# Altium schematic sheet Priority_Encoder.SchDoc
size 431 x 279 mm; Organization: ORGANIZATION; Address1: ADDRESS 1; Address2: ADDRESS 2; Address3: ADDRESS 3; Address4: ADDRESS 4; Revision: -; SheetNumber: 2; SheetTotal: 4; ENG_APP_DATE: --/--/--; DSN_APP_DATE: --/--/--; CHK_APP_DATE: --/--/--
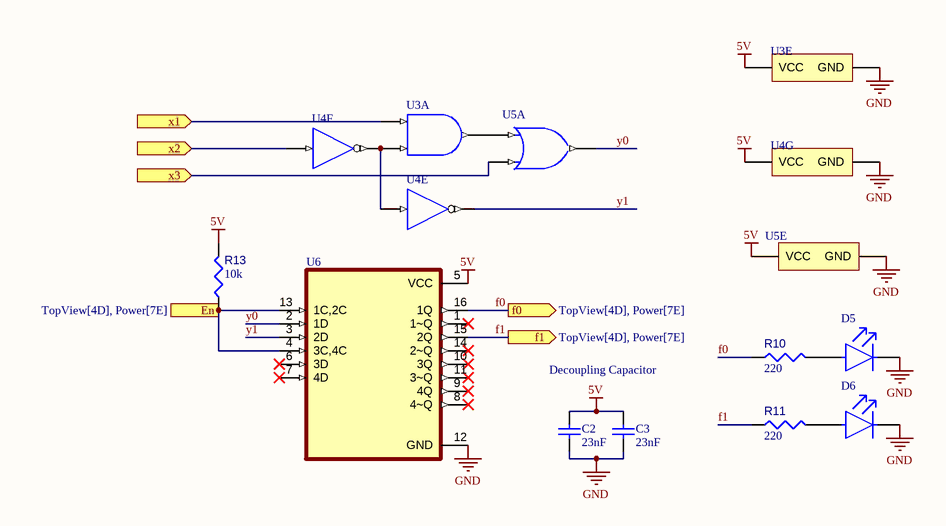
[diagram p0: Priority_Encoder.SchDoc]

## Parts
C2  23nF  [KEMT-C315-THT-2]
C3  23nF  [KEMT-C315-THT-2]
D5  LTL2P3KGKNN  [FP-LTL2P3KGKNN-MFG]  (value not drawn)
D6  LTL2P3KGKNN  [FP-LTL2P3KGKNN-MFG]  (value not drawn)
R10  value 220  [RESA60-630X240]  (hidden comment: MFR-25FBF52-100R)
R11  value 220  [RESA60-630X240]  (hidden comment: MFR-25FBF52-100R)
R13  10k  [RESA60-630X240]
U3  SN74LS08N  [N0014A]  (value not drawn)  (parts A,E of 5)
U4  SN74LS04N  [N0014A]  (value not drawn)  (parts E,F,G of 7)
U5  SN74LS32N  [N0014A]  (value not drawn)  (parts A,E of 5)
U6  SN74LS75N  [DIP794W45P254L1969H508Q16]  (value not drawn)

## Ports
En (in, see TopView[4D], Power[7E]), f0 (out, see TopView[4D], Power[7E]), f1 (out, see TopView[4D], Power[7E]), x1 (in, see TopView[5E], ADC_Logic[5C]), x2 (in, see TopView[5E], ADC_Logic[5D]), x3 (in, see TopView[5E], ADC_Logic[5D])

## Nets
5V: C2.2 C3.2 R13.2 U3.14(VCC) U4.14(VCC) U5.14(VCC) U6.5(VCC)
GND: C2.1 C3.1 D5.1(C) D6.1(C) U3.7(GND) U4.7(GND) U5.7(GND) U6.12(GND)
En: R13.1 U6.4(3C,4C) U6.13(1C,2C) ; port En
f0: R10.1 U6.16(1Q) ; port f0
f1: R11.1 U6.15(2Q) ; port f1
x1: U3.1(1A) ; port x1
x2: U4.13(6A) ; port x2
x3: U5.2(1B) ; port x3
y0: U5.3(1Y) U6.2(1D)
y1: U4.10(~{5Y}) U6.3(2D)
NetD5_2: D5.2(A) R10.2
NetD6_2: D6.2(A) R11.2
NetU3_2: U3.2(1B) U4.11(5A) U4.12(~{6Y})
NetU3_3: U3.3(1Y) U5.1(1A)

Not connected (* = marked no-connect by the designer): U6 1(1~Q)* 6(3D)* 7(4D)* 8(4~Q)* 9(4Q)* 10(3Q)* 11(3~Q)* 14(2~Q)*

## Notes on the sheet
- Decoupling Capacitor
- DWG. NO.
- REV.
- SHT.
- THIS DOCUMENT AND THE DATA DISCLOSED HEREIN OR HEREWITH IS THE PROPERTY OF ALTIUM LIMITED AND MAY BE FREELY DISTRIBUTED IN WHOLE. NO RIGHTS ARE RESERVED OR EXPRESS OR IMPLIED WARANTEE GIVEN.
- REVISION
- DESCRIPTION
- DATE
- APPROVED
- ENG:
- APPROVALS
- PROJECT
- DSN:
- CHK:
- REFERENCE DOCUMENTS
- PROJECT REVISION:
- TITLE
- DOCUMENT REVISION:
- DESIGN ITEM:
- BOM:
- FAB DWG:
- PCB DWG:
- ASSY DWG:
- SCALE:
- SIZE
- B
- CAGE CODE
- FILE NAME
- DWG NO.
- SHEET
- OF
- REV

## Library data of the parts
C2 C3 = CMP-1664-00007-1: Capacitor, Ceramic, 0.01 uF, +/- 10%, 100 V, X7R, -55 to 125 degC, 2-Pin THD, RoHS, Bulk; Output Voltage: 70 V; Case\Package: PDIP; Forward Current: 60 mA; Nominal Vf: 1.3 V; Forward Voltage: 1.5 V; Channels: 2; Max Power Dissipation: 400 mW; Vce Max: 500 mV; ComponentLink1Description: Manufacturer URL; ComponentLink2Description: Datasheet; Packaging: Rail/Tube; RoHSCompliant: true; Package Quantity: 2000; PackageReference: C315-THT-2; Min Operating Temperature: -55 degC; Max Operating Temperature: 100 degC; Radiation Hardening: No; ComponentLink1URL: http://www.kemet.com/; DatasheetVersion: Aug-16; Pins: 16; PackageDescription: 2-Pin Through Hole Device, Body 3.81 x 2.54 mm; REACH SVHC: Unknown; Mount: Through Hole; ComponentLink2URL: http://capacitoredge.kemet.com/capedge2/DataSheet/Datasheet-C315C103K1R5TA.pdf?pn=C315C103K1R5TA{BULK}
D5 D6 = CMP-22017-000002-1: LED GREEN CLEAR T-1 3/4 T/H; Manufacturer: Lite-On; Forward Voltage: 2.1V; Led Orientation: Straight; Forward Current: 20mA; Luminous Intensity: 980mcd; Wavelength: 572nm; Power Dissipation: 75mW; Peak Emmision Wavelength: 575nm; Viewing Angle: 22°; Reverse Voltage: 5V; Category: Diode; Temperature Range Low: -40°C; Device Class L1: Optoelectronics; Temperature: -40°C to +100°C; Mouser Description: LED Uni-Color Green 575nm 2-Pin T-1 3/4; Height: 9.95mm; Package: 0; Colour: Green; ComponentLink2Description: Datasheet; Digikey Description: LED GREEN CLEAR T-1 3/4 T/H; Automotive: No; Lead Free: Yes; ComponentLink2URL: https://optoelectronics.liteon.com/upload/download/DS20-2000-193/LTL2P3KGKNN.pdf; Manufacturer Part Number: LTL2P3KGKNN; Temperature Range High: +100°C; RoHS: TRUE; Device Class L2: LEDs; Device Class L3: unset; Octopart: https://octopart.com/ltl2p3kgknn-lite-on-550036
R10 R11 R13 = CMP-009-00046-4: Axial Resistor, 100 Ohm, +/- 1%, 0.25 W, -55 to 155 degC, 2-Pin THD, RoHS, Bulk; Manufacturer: Yageo; Voltage Rating: 250V; Power: 250mW; Packaging: Bulk; Max Operating Temperature: 155°C; Mounting Technology: TH; Datasheet Version: Apr-13; Case/Package: Axial; RoHS Compliant: True; Package Description: 2-Pin Axial Lead, Dia 2.4 mm, Body Length 6.3 mm; Package Quantity: 200; Package Reference: MFR-25; Tolerance: 1%; Composition: CarbonFilm; Datasheet URL: http://www.yageo.com/documents/recent/Yageo%20LR_MFR_2013.pdf; Manufacturer URL: http://www.yageo.com/; Min Operating Temperature: -55°C
  R13: Value: 10k
U3 = CMP-0777-00259-3: Quadruple 2-Input Positive-AND Gates, N0014A, TUBE; Manufacturer: Texas Instruments; VCC(Max)(V): 5.25; ICC @ Nom Voltage(Max)(mA): 0.021; VCC(Min)(V): 4.75; tpd @ Nom Voltage(Max)(ns): 25; Rating: Catalog; Output Type: TTL; Bits(#): 4; Schmitt Trigger: No; Voltage(Nom)(V): 5; Technology Family: LS; F @ Nom Voltage(Max)(Mhz): 35; Output Drive (IOL/IOH)(Max)(mA): -0.8/16; PackageReference: N0014A; DatasheetVersion: SDLS033; Input Type: TTL; Operating Temperature Range(C): 0 to 70; Generic Part Number: SN74LS08
U4 = CMP-1615-00911-2: Hex inverters, N0014A, TUBE; Manufacturer: Texas Instruments; Output Drive (IOL/IOH)(Max)(mA): -0.4/8; Schmitt Trigger: No; F @ Nom Voltage(Max)(Mhz): 35; Voltage(Nom)(V): 5; Technology Family: LS; Input Type: TTL; Output Type: CMOS; Bits(#): 6; VCC(Max)(V): 5.25; ICC @ Nom Voltage(Max)(mA): 0.033; Rating: Catalog; VCC(Min)(V): 4.75; tpd @ Nom Voltage(Max)(ns): 22; Operating Temperature Range(C): 0 to 70; DatasheetVersion: SDLS029C; Generic Part Number: SN74LS04; Code_JEDEC: MS-001; PackageReference: N0014A
U5 = CMP-1573-00145-3: Quad 2-input positive-OR gates, N0014A, TUBE; Manufacturer: Texas Instruments; tpd @ Nom Voltage(Max)(ns): 22; Output Drive (IOL/IOH)(Max)(mA): 0.8/-16; Input Type: TTL; VCC(Min)(V): 4.75; F @ Nom Voltage(Max)(Mhz): 35; Voltage(Nom)(V): 5; ICC @ Nom Voltage(Max)(mA): 0.038; VCC(Max)(V): 5.25; Rating: Catalog; Bits(#): 4; Generic Part Number: SN74LS32; DatasheetVersion: SDLS100; Operating Temperature Range(C): 0 to 70; Output Type: TTL; Code_JEDEC: MS-001; PackageVersion: http://www.ti.com/lit/ml/mpdi002c/mpdi002c.pdf; PackageReference: N0014A
U6 = SN74LS75N: Quad bistable latches; MF: Texas Instruments; Price: None; Availability: In Stock; MP: SN74LS75N; Package: PDIP-16 Texas Instruments; SnapEDA_Link: https://www.snapeda.com/parts/SN74LS75N/Texas+Instruments/view-part/?ref=snap; Check_prices: https://www.snapeda.com/parts/SN74LS75N/Texas+Instruments/view-part/?ref=eda; Value: *; Purchase-URL: https://pricing.snapeda.com/search/part/SN74LS75N/?ref=eda